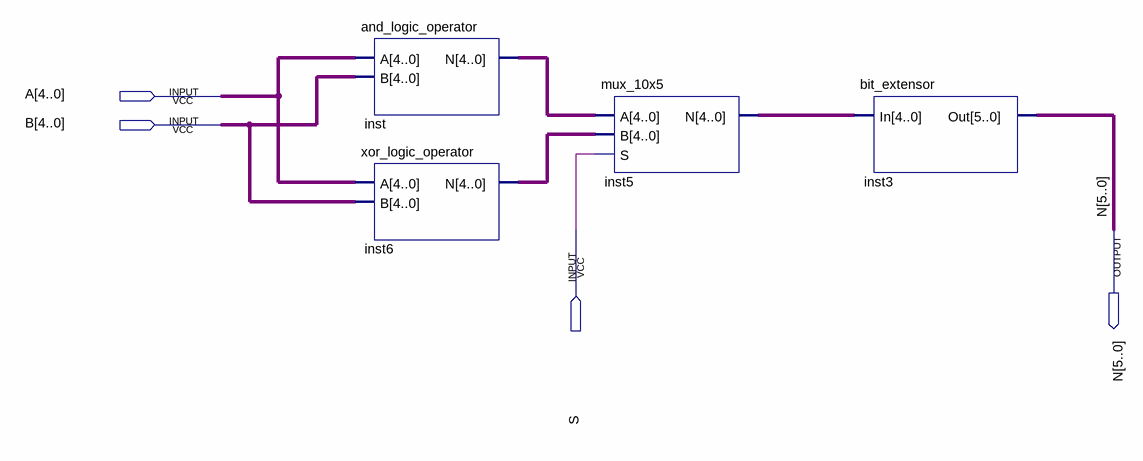
[diagram p0: schematic sheet]
// Quartus schematic logic_unit.bdf as structural Verilog: 4 symbols, 4 pins
module logic_unit (
  input  [4:0] A,
  input  [4:0] B,
  input  S,
  output [5:0] N
);

  wire [4:0] inst5_n, inst6_n, inst_n;

  and_logic_operator inst (.A(A), .B(B), .N(inst_n));
  xor_logic_operator inst6 (.A(A), .B(B), .N(inst6_n));
  mux_10x5 inst5 (.A(inst_n), .B(inst6_n), .S(S), .N(inst5_n));
  bit_extensor inst3 (.In(inst5_n), .Out(N));
endmodule
